# EAGLE schematic people_counter_v1 (EAGLE 9.6.2)

## Sheet 1 of 2
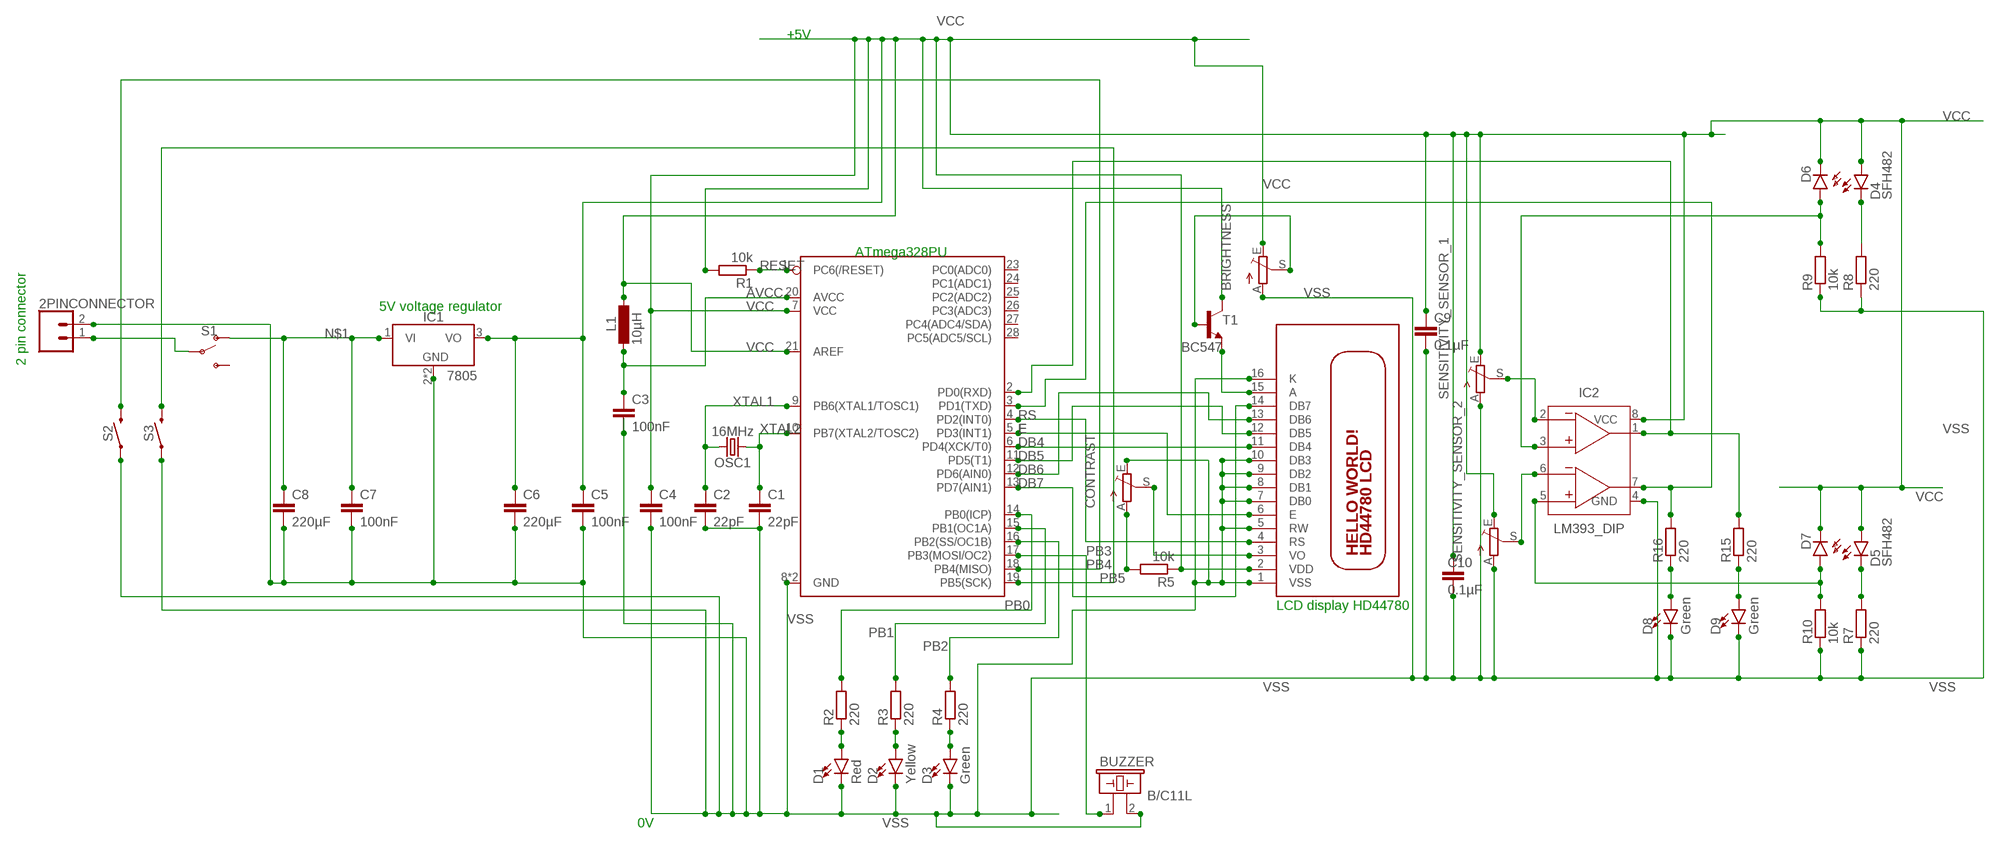
[diagram p0: schematic, sheet 1]

### Parts
2PINCONNECTOR  CONN_02  [1X02]
BRIGHTNESS  TRIM_EU-PT10S  [PT-10S]
BUZZER  B/C11L  [B/C11L]
C1  22pF  C-EUC0805  [C0805]
C2  22pF  C-EUC0805  [C0805]
C3  100nF  C-EUC0805  [C0805]
C4  100nF  C-EUC0805  [C0805]
C5  100nF  C-EUC0805  [C0805]
C6  220µF  C-EUC0805  [C0805]
C7  100nF  C-EUC0805  [C0805]
C8  220µF  C-EUC0805  [C0805]
C9  0.1µF  C-EUC0805  [C0805]
C10  0.1µF  C-EUC0805  [C0805]
CONTRAST  TRIM_EU-PT10S  [PT-10S]
D1  Red  LED-RED-0603-WE  [LED-0603]
D2  Yellow  LED-YELLOW-0603-WE  [LED-0603]
D3  Green  LED-GREEN-0603-WE  [LED-0603]
D4  SFH482  [SFH482]
D5  SFH482  [SFH482]
D6  BP104  [BP104]
D7  BP104  [BP104]
D8  Green  LED-GREEN-0603-WE  [LED-0603]
D9  Green  LED-GREEN-0603-WE  [LED-0603]
IC1  7805  LM7805_SOT223  [SOT230P700X170-4]
IC2  LM393_DIP  [DIP826W53P254L959H508Q8B]
L1  10µH  L-EUL1812  [L1812]
OSC1  16MHz  CRYSTAL-16MHZPTH-HC49US  [HC49US]
R1  10k  R-EU_R0603  [R0603]
R2  220  R-EU_R0603  [R0603]
R3  220  R-EU_R0603  [R0603]
R4  220  R-EU_R0603  [R0603]
R5  10k  R-EU_R0603  [R0603]
R7  220  R-EU_R0603  [R0603]
R8  220  R-EU_R0603  [R0603]
R9  10k  R-EU_R0603  [R0603]
R10  10k  R-EU_R0603  [R0603]
R15  220  R-EU_R0603  [R0603]
R16  220  R-EU_R0603  [R0603]
S1  SWITCH-SPDT-PTH-11.6X4.0MM  [SWITCH_SPDT_PTH_11.6X4.0MM]
S2  MOMENTARY-SWITCH-SPST-PTH-6.0MM  [TACTILE_SWITCH_PTH_6.0MM]
S3  MOMENTARY-SWITCH-SPST-PTH-6.0MM  [TACTILE_SWITCH_PTH_6.0MM]
SENSITIVITY_SENSOR_1  TRIM_EU-PT10S  [PT-10S]
SENSITIVITY_SENSOR_2  TRIM_EU-PT10S  [PT-10S]
T1  BC547  [TO92]
U1  328P  ATMEGA328P_PDIP  [DIP28]
X1  HD44780LCD-1602  [LCD1602]

### Nets
AVCC: C3.1 L1.2 U1.20(AVCC)
DB4: U1.6(PD4(XCK/T0)) X1.11(DB4)
DB5: U1.11(PD5(T1)) X1.12(DB5)
DB6: U1.12(PD6(AIN0)) X1.13(DB6)
DB7: U1.13(PD7(AIN1)) X1.14(DB7)
E: U1.5(PD3(INT1)) X1.6(E)
N$1: C7.1 C8.1 IC1.1(VI) S1.1(O)
N$2: BRIGHTNESS.S T1.2(B)
N$3: 2PINCONNECTOR.1 S1.2(P)
N$4: D1.A R2.1
N$6: D2.A R3.1
N$8: CONTRAST.A R5.2
N$9: D3.A R4.1
N$10: D6.A IC2.3(+IN1) R9.2
N$12: D7.A IC2.5(+IN2) R10.2
N$14: D5.K(C) R7.2
N$16: D4.K(C) R8.2
N$17: IC2.1(OUT1) R15.2 U1.2(PD0(RXD))
N$18: IC2.7(OUT2) R16.2 U1.3(PD1(TXD))
N$19: IC2.2(-IN1) SENSITIVITY_SENSOR_1.S
N$20: IC2.6(-IN2) SENSITIVITY_SENSOR_2.S
N$23: T1.1(E) X1.15(A)
N$24: D9.A R15.1
N$25: D8.A R16.1
PB0: R2.2 U1.14(PB0(ICP))
PB1: R3.2 U1.15(PB1(OC1A))
PB2: R4.2 U1.16(PB2(SS/OC1B))
PB3: BUZZER.1 U1.17(PB3(MOSI/OC2))
PB4: S2.3 U1.18(PB4(MISO))
PB5: S3.3 U1.19(PB5(SCK))
RESET: R1.1 U1.1(PC6(/RESET))
RS: U1.4(PD2(INT0)) X1.4(RS)
VCC: BRIGHTNESS.E C4.1 C5.1 C6.1 C9.1 C10.1 D4.A D5.A D6.K(C) D7.K(C) IC1.3(VO) IC2.8(VCC) L1.1 R1.2 R5.1 SENSITIVITY_SENSOR_1.E SENSITIVITY_SENSOR_2.E T1.3(C) U1.7(VCC) U1.21(AREF) X1.2(VDD)
VO: CONTRAST.S X1.3(VO)
VSS: 2PINCONNECTOR.2 BRIGHTNESS.A BUZZER.2 C1.2 C2.2 C3.2 C4.2 C5.2 C6.2 C7.2 C8.2 C9.2 C10.2 CONTRAST.E D1.C D2.C D3.C D8.C D9.C IC1.2(GND) IC1.4(GND) IC2.4(GND) R7.1 R8.1 R9.1 R10.1 S2.1 S3.1 SENSITIVITY_SENSOR_1.A SENSITIVITY_SENSOR_2.A U1.8(GND) U1.22(GND) X1.1(VSS) X1.5(RW) X1.7(DB0) X1.8(DB1) X1.9(DB2) X1.10(DB3) X1.16(K)
XTAL1: C2.1 OSC1.2 U1.9(PB6(XTAL1/TOSC1))
XTAL2: C1.1 OSC1.1 U1.10(PB7(XTAL2/TOSC2))
Unconnected: S1.3(S) U1.23(PC0(ADC0)) U1.24(PC1(ADC1)) U1.25(PC2(ADC2)) U1.26(PC3(ADC3)) U1.27(PC4(ADC4/SDA)) U1.28(PC5(ADC5/SCL))

### Notes on the sheet
- +5V
- ATmega328PU
- 5V voltage regulator
- 2 pin connector
- LCD display HD44780
- 0V

## Sheet 2 of 2

## Library data of the parts
2PINCONNECTOR = SparkFun-Connectors:CONN_02: Multi connection point. Often used as Generic Header-pin footprint for 0.1 inch spaced/style header connections On any of the 0.1 inch spaced packages, you can populate with these: Break Away Headers - Straight <https://www.sparkfun.com/products/116> (PRT-00116) Break Away Male Headers - Right Angle <https://www.sparkfun.com/products/553> (PRT-00553) Female Headers <https://www.sparkfun.com/products/115> (PRT-00115) Break Away Headers - Machine Pin <https://www.sparkfun.com/products/117> (PRT-00117) Break Away Female Headers - Swiss Machine Pin <https://www.sparkfun.com/products/743> (PRT-00743) For SCREWTERMINALS and SPRING TERMINALS visit here: Screw Terimnals on SparkFun.com <https://www.sparkfun.com/search/results?term=Screw+Terminals> (5mm/3.5mm/2.54mm spacing) This device is also useful as a general connection point to wire up your design to another part of your project. Our various solder wires solder well into these plated through hole pads. Hook-Up Wire - Assortment (Stranded, 22 AWG) <https://www.sparkfun.com/products/11375> (PRT-11375) Hook-Up Wire - Assortment (Solid Core, 22 AWG) <https://www.sparkfun.com/products/11367> (PRT-11367) View the entire wire category on our website here <https://www.sparkfun.com/categories/141> Special notes: Molex polarized connector foot print use with: PRT-08233 with associated crimp pins and housings. 2.54_SCREWTERM for use with PRT-10571. 3.5mm Screw Terminal footprints for PRT-08084 5mm Screw Terminal footprints for use with PRT-08432
BRIGHTNESS CONTRAST SENSITIVITY_SENSOR_1 SENSITIVITY_SENSOR_2 = pot:TRIM_EU-: POTENTIOMETER
BUZZER = buzzer:B/C11L: BUZZER Source: Buerklin; OC_FARNELL: unknown; OC_NEWARK: unknown
C1-C10 = rcl:C-EU: CAPACITOR, European symbol; SPICEPREFIX: C
D1 = SparkFun-LED:LED-RED: Red SMD LED Used in manufacturing of most products at SparkFun Packages: 0603 - KB - KingBright (DIO-17976) SMD 0603 package [Datasheet] <https://www.kingbrightusa.com/images/catalog/SPEC/APT1608SURCK.pdf> 0603 - (DIO-00819, has gone EOL) SMD 0603 package 0603 SMART - SMD 0603 SMART package ( more efficient and expensive)[Product Link] <http://www.osram-os.com/Graphics/XPic2/00077099_0.pdf> 1206 - SMD1206 package [Product Link] <https://www.sparkfun.com/datasheets/DevTools/LilyPad/Q150OVS4.pdff> SparkFun Products: Pro Mini 328 -5V <https://www.sparkfun.com/products/821> RedBoard <https://www.sparkfun.com/products/12757> IOIO-OTG <https://www.sparkfun.com/products/13613>; PROD_ID: DIO-16511
D2 = SparkFun-LED:LED-YELLOW: Yellow SMD LED Used in manufacturing several products at SparkFun. Packages: 0603 - SMD 0603 package[Product Link] <http://www.kingbrightusa.com/product.asp?catalog_name=LED&product_id=APT1608SYCK> 0603 -SMART - SMART SMD 0603 package (more efficient/more expensive) [Product Link] <http://www.osram-os.com/osram_os/en/products/product-catalog/led-light-emitting-diodes/smartled-0603/ly-l29k/index.jsp> LilyPad - SMD1206 package[Product Datasheet] <https://www.sparkfun.com/datasheets/DevTools/LilyPad/Q150YUS4.pdf> SparkFun Products: Blynk Board <https://www.sparkfun.com/products/13794> IOIO-OTG <https://www.sparkfun.com/products/13613> XBee Explorer Serial <https://www.sparkfun.com/products/13225>; PROD_ID: DIO-16514
D3 D8 D9 = SparkFun-LED:LED-GREEN: Green SMD LED Used in manufacturing of various products at SparkFun Packages: 0603 - SMD 0603 package [Product Link] <http://www.futureelectronics.com/en/technologies/semiconductors/optoelectronics/leds/Pages/9894312-LTST-C190GKT.aspx?CrossPart=HSMG-C190&IM=0> LilyPad 1206 - SMD1206 LilyPad package [Product Link] <http://www.futureelectronics.com/en/Technologies/Product.aspx?ProductID=IN150NGHARVATEKCORPORATION2049943&IM=0> 1206 - SMD1206 package [Product Link] <http://www.futureelectronics.com/en/technologies/semiconductors/optoelectronics/leds/Pages/8315665-LTST-C150KGKT.aspx?IM=0> 1206 Bottom Mount -SMD 1206 Bottom Mount [Product Link] <http://www.digikey.com/product-detail/en/lite-on-inc/LTST-C230KGKT/160-1456-1-ND/386854> SparkFun Products: Pro Mini 328 -5V <https://www.sparkfun.com/products/821> RedBoard <https://www.sparkfun.com/products/12757> MP3 Trigger <https://www.sparkfun.com/products/13720> Makey Makey <https://www.sparkfun.com/products/11076>; PROD_ID: DIO-16512
D4 D5 = led:SFH482: IR LED infrared emitting diode, Infineon
D6 D7 = opto-trans-siemens:BP104: PHOTO DIODE; MF: VISHAY/TELEFUNKEN; MPN: BP104; OC_FARNELL: 1779636; OC_NEWARK: 14M4504
IC1 = IC_Power-Management:LM7805: 5V Voltage Regulator Reference Datasheet <https://www.ti.com/lit/ds/symlink/lm340.pdf>; CATEGORY: IC_Logic; DESCRIPTION: 5V Voltage Regulator; MANUFACTURER: Generic; MPN: Generic; SERIES: LM7805; SUB-CATEGORY: Voltage Regulator; TYPE: 5V
IC2 = Tinkercad:LM393: Dual Comparators Reference Datasheet <https://www.ti.com/lit/ds/symlink/lm393-n.pdf?ts=1637561071595&ref_url=https%253A%252F%252Fwww.google.com%252F>
L1 = rcl:L-EU: INDUCTOR, European symbol; SPICEPREFIX: L
OSC1 = SparkFun-Clocks:CRYSTAL-16MHZ: 16MHz Crystal Digikey Example <http://www.digikey.com/product-search/en?keywords=535-9122-1-ND> Frequency: 16MHz Frequency Stability: ±50ppm Frequency Tolerance: ±20ppm Load Capacitance: 18pF SparkFun Products: Pro Micro -5V/16MHz <https://www.sparkfun.com/products/12640> SparkFun Serial Enabled LCD Kit <https://www.sparkfun.com/products/10097>; PROD_ID: XTAL-08181; SF_ID: COM-00536
R1-R5 R7-R10 R15 R16 = rcl:R-EU_: RESISTOR, European symbol; SPICEPREFIX: R
S1 = SparkFun-Switches:SWITCH-SPDT: Single Pole, Double Throw (SPDT) Switch Single-pole, double-throw (SPDT) switch. Variant Overview SMD-AYZ0202 Surface Mount DPDT Switch <https://www.sparkfun.com/products/597> (COM-00597) Used on e.g. LilyPad Arduino USB - ATmega32U4 Board <https://www.sparkfun.com/products/12049> PTH-11.6X4.0MM SPDT Mini Power Switch <https://www.sparkfun.com/products/102> (COM-00102) Used on e.g. SparkFun Simon Says - Through-Hole Soldering Kit <https://www.sparkfun.com/products/10547> (KIT-10547) PTH-11.6X4.0MM-KIT KIT version of SPDT Mini Power Switch - Simplifies soldering by removing tStop of switch pins - only one side can be soldered. PTH-11.6X4.0MM-LOCK LOCK version of SPDT Mini Power Switch - Offset pins hold switch in place for easier soldering. SMD-RIGHT-ANGLE Surface Mount Right Angle Switch <https://www.sparkfun.com/products/10860> (COM-10860) Used on e.g. SparkFun ESP8266 Thing <https://www.sparkfun.com/products/13231>; PROD_ID: SWCH-08261; SF_SKU: COM-00102
S2 S3 = SparkFun-Switches:MOMENTARY-SWITCH-SPST: Momentary Switch (Pushbutton) - SPST Normally-open (NO) SPST momentary switches (buttons, pushbuttons). Variants PTH-12MM - 12mm square, through-hole Momentary Pushbutton Switch - 12mm Square <https://www.sparkfun.com/products/9190> (COM-09190) PTH-6.0MM, PTH-6.0MM-KIT - 6.0mm square, through-hole Mini Pushbutton Switch <https://www.sparkfun.com/products/97> (COM-00097) KIT package intended for soldering kit's - only one side of pads' copper is exposed. PTH-RIGHT-ANGLE-KIT - Right-angle, through-hole Right Angle Tactile Button <https://www.sparkfun.com/products/10791> - Used on SparkFun BigTime Watch Kit <https://www.sparkfun.com/products/11734> SMD-12MM - 12mm square, surface-mount Tactile Button - SMD (12mm) <https://www.sparkfun.com/products/12993> (COM-12993) Used on SparkFun PicoBoard <https://www.sparkfun.com/products/11888> SMD-4.5MM - 4.5mm Square Trackball Switch Used on SparkFun Blackberry Trackballer Breakout <https://www.sparkfun.com/products/13169> SMD-4.6MMX2.8MM - 4.60mm x 2.80mm, surface mount Used on SparkFun Pro Micro - RP2040 <https://www.sparkfun.com/products/17717> SMD-5.2MM, SMD-5.2-REDUNDANT - 5.2mm square, surface-mount Mini Pushbutton Switch - SMD <https://www.sparkfun.com/products/8720> (COM-08720) Used on Arduino Pro Mini <https://www.sparkfun.com/products/11114> REDUNDANT package connects both switch circuits together SMD-6.0X3.5MM - 6.0 x 3.5mm, surface mount Momentary Reset Switch SMD <https://www.sparkfun.com/products/8229> (COM-08229) SMD-6.2MM-TALL - 6.2mm square, surface mount Tactile Button - SMD (6mm) <https://www.sparkfun.com/products/12992> Used on SparkFun Digital Sandbox <https://www.sparkfun.com/products/12651> SMD-RIGHT-ANGLE - Right-angle, surface mount Used on SparkFun Block for Intel® Edison - Arduino <https://www.sparkfun.com/products/13036>; PROD_ID: SWCH-08441; SF_SKU: COM-00097
T1 = transistor:BC547: NPN TRANSISTOR
U1 = SparkFun-IC-Microcontroller:ATMEGA328P_PDIP: Atmel 328P Through hole ATMEGA328P uC used in the Arduino 32kb flash, 1k EEPROM, 2k SRAM Datasheet <http://www.sparkfun.com/datasheets/Components/SMD/ATMega328.pdf> SparkFun Products Storefront component: AVR 28 Pin 20MHz 32K 6A/D - ATMega328P <https://www.sparkfun.com/products/9061> (COM-09061) SparkFun Simon Says - Through-Hole Soldering Kit <https://www.sparkfun.com/products/10547> (KIT-10547) SparkFun Learn to Solder - Simon Says <https://www.sparkfun.com/products/13708> (KIT-13708) SparkFun BigTime Watch Kit <https://www.sparkfun.com/products/11734> (KIT-11734) SparkFun ClockIt <https://www.sparkfun.com/products/10930> (KIT-10930) SparkFun Serial Enabled LCD Kit <https://www.sparkfun.com/products/10097> (LCD-10097) SparkFun Simon Tilts - Through Hole Soldering Kit <https://www.sparkfun.com/products/12634> (KIT-12634) SparkFun Frequency Counter Kit <https://www.sparkfun.com/products/10140> (KIT-10140) FabFM Radio Kit <https://www.sparkfun.com/products/11043> (KIT-11043) SparkFun Binary Blaster Kit <https://www.sparkfun.com/products/12037> (KIT-12037) SparkFun Metro-Gnome <https://www.sparkfun.com/products/9236> (KIT-09236) ATmega328 with Arduino Optiboot (Uno) <https://www.sparkfun.com/products/10524> (DEV-10524); PROD_ID: IC-09136
X1 = adafruit:HD44780LCD: HD44780 LCD Standard character type LCDs, available in sizes from 8x1 to 40x4!

## Net classes
0 default: clearance 0.5 mm